# Altium schematic sheet input.SchDoc: Input
size A4
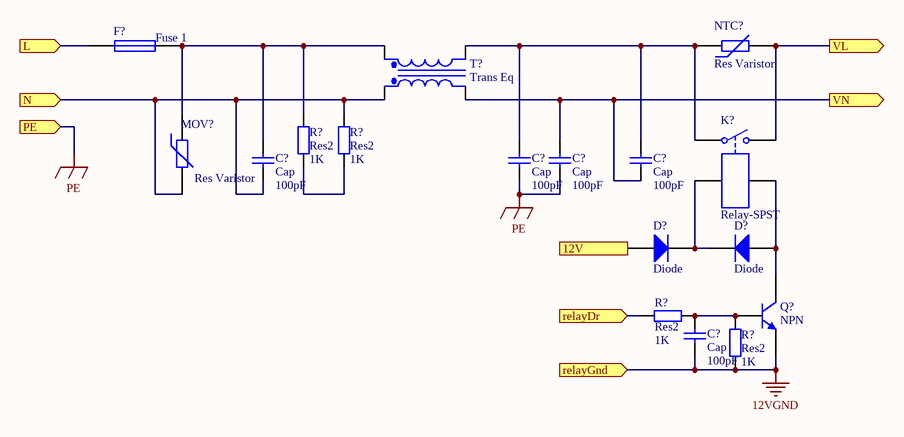
[diagram p0: input.SchDoc]

## Parts
(Parts that share a designator on the sheet are numbered #1, #2 ... from top to bottom, then left to right.)
C?#1  Cap  value 100pF  [RAD-0.3]
C?#2  Cap  value 100pF  [RAD-0.3]
C?#3  Cap  value 100pF  [RAD-0.3]
C?#4  Cap  value 100pF  [RAD-0.3]
C?#5  Cap  value 100pF  [RAD-0.3]
D?#1  Diode  [SMC]
D?#2  Diode  [SMC]
F?  Fuse 1  [PIN-W2/E2.8]
K?  Relay-SPST  [MODULE4]
MOV?  Res Varistor  [6-0805_N]
NTC?  Res Varistor  [6-0805_N]
Q?  NPN  [TO-226-AA]
R?#1  Res2  value 1K  [AXIAL-0.4]
R?#2  Res2  value 1K  [AXIAL-0.4]
R?#3  Res2  value 1K  [AXIAL-0.4]
R?#4  Res2  value 1K  [AXIAL-0.4]
T?  Trans Eq  [TRF_4]

## Ports
12V (in), L (in), N (in), PE (in), relayDr (in), relayGnd (in), VL (out), VN (out)

## Nets
12VGND: C?#5.1 Q?.3(E) R?#4.2 ; port relayGnd
PE: C?#2.1 C?#3.1 ; port PE
12V: D?#1.1(A) ; port 12V
L: F?.1 ; port L
N: C?#1.1 MOV?.2 R?#2.2 T?.1(Pri+) ; port N
relayDr: R?#3.2 ; port relayDr
VL: K?.2 NTC?.2 ; port VL
VN: C?#3.2 C?#4.1 T?.2(Pri-) ; port VN
NetC?#1_2: C?#1.2 F?.2 MOV?.1 R?#1.2 T?.3(Sec+)
NetC?#2_2: C?#2.2 C?#4.2 K?.1 NTC?.1 T?.4(Sec-)
NetC?#5_2: C?#5.2 Q?.2(B) R?#3.1 R?#4.1
NetD?#1_2: D?#1.2(K) D?#2.2(K) K?.3
NetD?#2_1: D?#2.1(A) K?.4 Q?.1(C)
NetR?#1_1: R?#1.1 R?#2.1

## Notes on the sheet
- Title
- Size:
- Date:
- A4
- Number:
- Time:
- Revision:
- Sheet
- of
- File:

## Library data of the parts
C?#1-C?#5 = Cap: Capacitor; Published: 8-Jun-2000; LatestRevisionDate: 17-Jul-2002; LatestRevisionNote: Re-released for DXP Platform.; PackageReference: RAD-0.3; Publisher: Altium Limited; PackageDescription: Radial Cap, Thru-Hole; 2 Leads; 0.3 in Pin Spacing
D?#1 D?#2 = Diode: Default Diode; Published: 8-Jun-2000; LatestRevisionDate: 17-Jul-2002; LatestRevisionNote: Re-released for DXP Platform.; PackageVersion: Sep-1996; PackageReference: SMC; Publisher: Altium Limited; PackageDescription: DO-214-AB/SMC; 2 C-Bend Leads; Body 7.9 x 5.9 mm, inc. leads (LxW); Code_JEDEC: DO-214-AB
F? = Fuse 1: Fuse; Published: 8-Jun-2000; LatestRevisionDate: 17-Jul-2002; LatestRevisionNote: Re-released for DXP Platform.; PackageReference: PIN-W2/E2.8; Publisher: Altium Limited; PackageDescription: Thru-Hole; 2 Leads
K? = Relay-SPST: Single-Pole Single-Throw Relay; Published: 24-Mar-1999; LatestRevisionDate: 17-Jul-2002; LatestRevisionNote: Re-released for DXP Platform.; PackageReference: MODULE4; Publisher: Altium Limited
MOV? NTC? = Res Varistor: Varistor (Voltage-Sensitive Resistor); Published: 24-Mar-1999; LatestRevisionDate: 29-May-2009; LatestRevisionNote: IPC-7351 Footprint Added.; PackageVersion: Mar-2003; PackageReference: 6-0805; Publisher: Altium Limited; PackageDescription: Chip Resistor 0805 Case Size; Code_IPC: RESC2012
Q? = NPN: NPN Bipolar Transistor; Published: 8-Jun-2000; LatestRevisionDate: 17-Jul-2002; LatestRevisionNote: Re-released for DXP Platform.; PackageReference: TO-226-AA; Publisher: Altium Limited; PackageDescription: TO, Flat Index; 3 In-Line, Axial Leads; Body Dia. 4.8mm; Leads 0.55 x 0.51 mm (max); Code_JEDEC: TO-226-AA
R?#1-R?#4 = Res2: Resistor; Published: 8-Jun-2000; LatestRevisionDate: 17-Jul-2002; LatestRevisionNote: Re-released for DXP Platform.; PackageReference: AXIAL-0.4; Publisher: Altium Limited; PackageDescription: Axial Device, Thru-Hole; 2 Leads; 0.4 in Pin Spacing
T? = Trans Eq: Transformer (Equivalent Circuit Model); Published: 8-Jun-2000; LatestRevisionDate: 17-Jul-2002; LatestRevisionNote: Re-released for DXP Platform.; PackageReference: TRF_4; Publisher: Altium Limited; PackageDescription: Transformer; 4 Leads